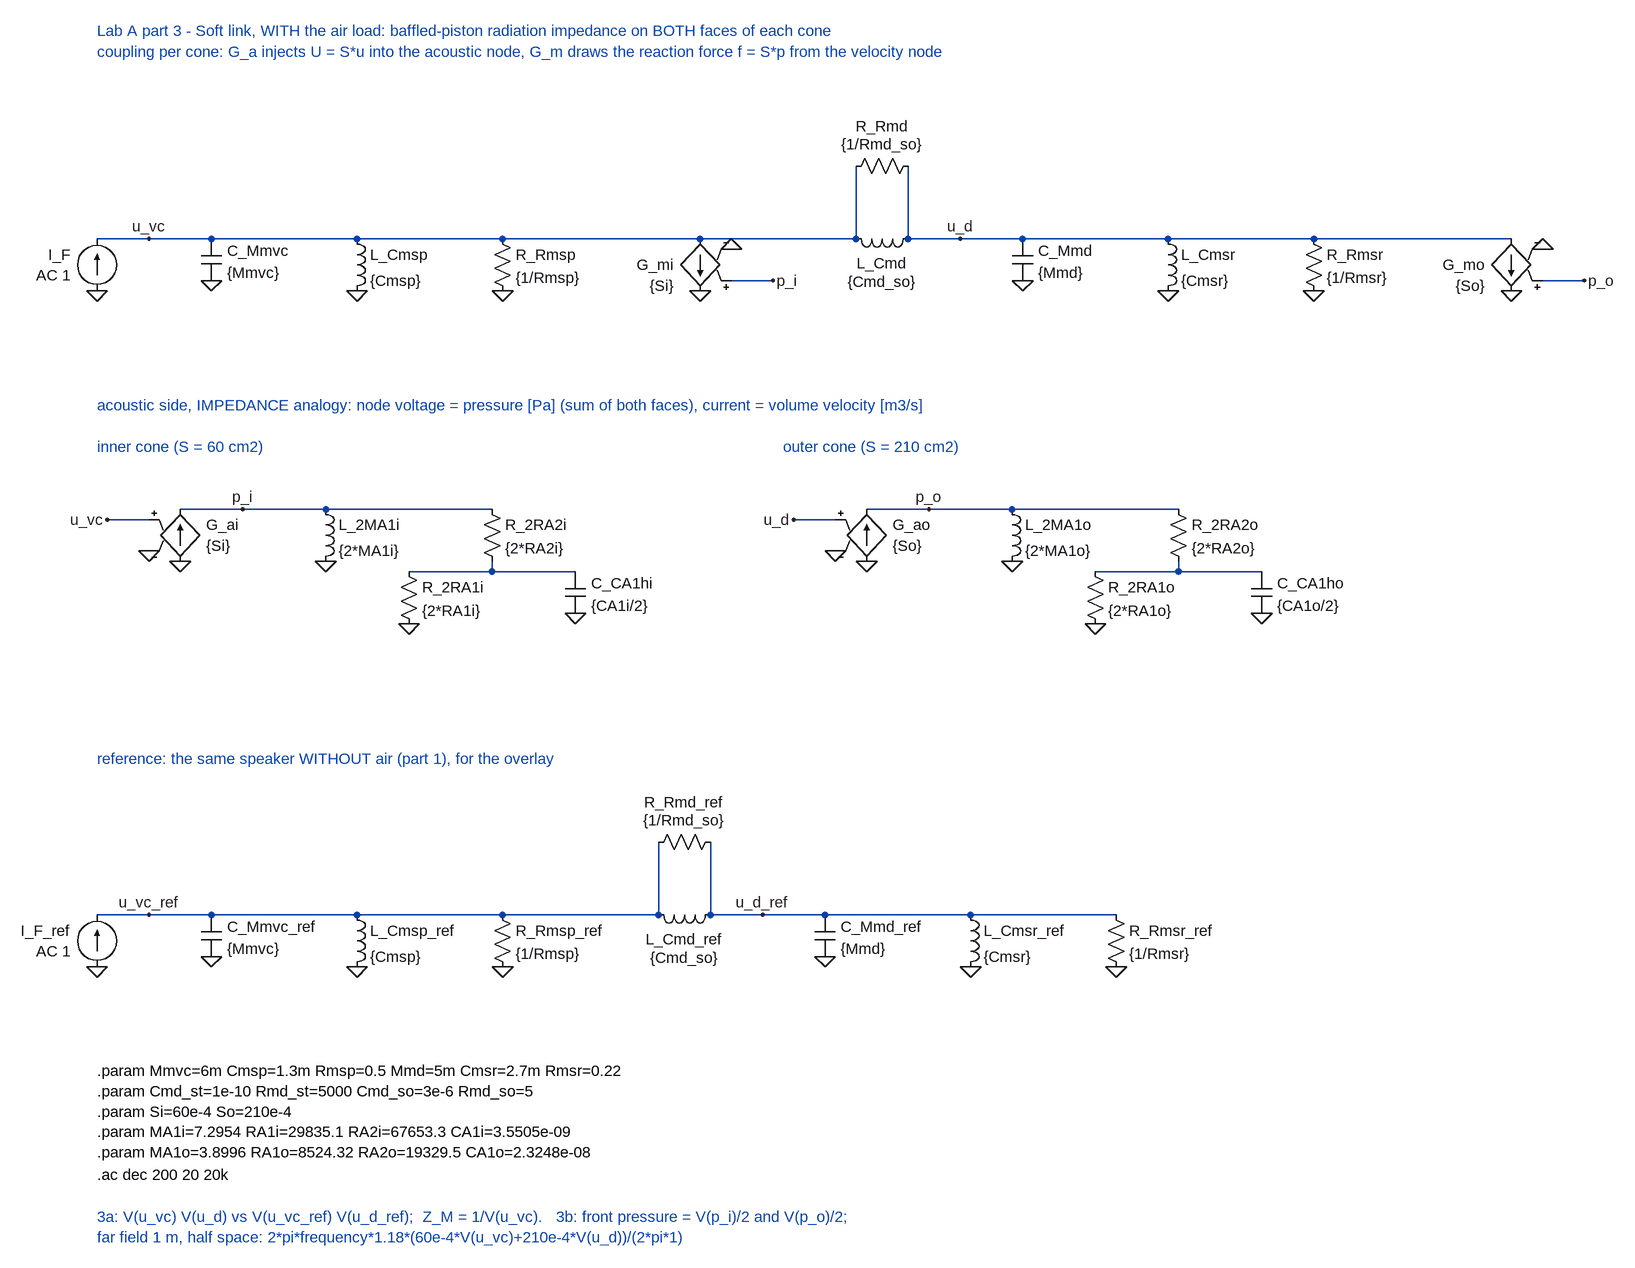
[diagram p0: schematic Part3_Coupled_Soft.asc]
Part3_Coupled_Soft.asc, the LTspice schematic file:
Version 4
SHEET 1 3000 1600
WIRE 976 64 1040 64
WIRE 0 0 1168 0
WIRE 1168 0 1168 -112
WIRE 1248 0 1248 -112
WIRE 2224 64 2288 64
WIRE 1248 0 2176 0
WIRE 80 432 16 432
WIRE 128 416 608 416
WIRE 608 496 608 512
WIRE 480 512 736 512
WIRE 1136 432 1072 432
WIRE 1184 416 1664 416
WIRE 1664 496 1664 512
WIRE 1536 512 1792 512
WIRE 0 1040 864 1040
WIRE 864 1040 864 928
WIRE 944 1040 944 928
WIRE 944 1040 1568 1040
FLAG 0 80 0
FLAG 80 0 u_vc
FLAG 176 64 0
FLAG 400 80 0
FLAG 624 80 0
FLAG 928 80 0
FLAG 976 16 0
FLAG 1040 64 p_i
FLAG 1328 0 u_d
FLAG 1424 64 0
FLAG 1648 80 0
FLAG 1872 80 0
FLAG 2176 80 0
FLAG 2224 16 0
FLAG 2288 64 p_o
FLAG 128 496 0
FLAG 80 480 0
FLAG 16 432 u_vc
FLAG 224 416 p_i
FLAG 352 496 0
FLAG 480 592 0
FLAG 736 576 0
FLAG 1184 496 0
FLAG 1136 480 0
FLAG 1072 432 u_d
FLAG 1280 416 p_o
FLAG 1408 496 0
FLAG 1536 592 0
FLAG 1792 576 0
FLAG 0 1120 0
FLAG 80 1040 u_vc_ref
FLAG 176 1104 0
FLAG 400 1120 0
FLAG 624 1120 0
FLAG 1024 1040 u_d_ref
FLAG 1120 1104 0
FLAG 1344 1120 0
FLAG 1568 1120 0
SYMBOL current 0 80 R180
WINDOW 0 40 56 Left 2
WINDOW 3 40 24 Left 2
SYMATTR InstName I_F
SYMATTR Value AC 1
SYMBOL cap 160 0 R0
WINDOW 0 40 18 Left 2
WINDOW 3 40 52 Left 2
SYMATTR InstName C_Mmvc
SYMATTR Value {Mmvc}
SYMBOL ind 384 -16 R0
SYMATTR InstName L_Cmsp
SYMATTR Value {Cmsp}
SYMATTR SpiceLine Rser=0
SYMBOL res 608 -16 R0
SYMATTR InstName R_Rmsp
SYMATTR Value {1/Rmsp}
SYMBOL g 928 96 R180
WINDOW 0 40 56 Left 2
WINDOW 3 40 24 Left 2
SYMATTR InstName G_mi
SYMATTR Value {Si}
SYMBOL ind 1264 -16 R90
WINDOW 0 38 56 VTop 2
WINDOW 3 66 56 VTop 2
SYMATTR InstName L_Cmd
SYMATTR Value {Cmd_so}
SYMATTR SpiceLine Rser=1u
SYMBOL res 1264 -128 R90
WINDOW 0 -30 56 VBottom 2
WINDOW 3 -2 56 VBottom 2
SYMATTR InstName R_Rmd
SYMATTR Value {1/Rmd_so}
SYMBOL cap 1408 0 R0
WINDOW 0 40 18 Left 2
WINDOW 3 40 52 Left 2
SYMATTR InstName C_Mmd
SYMATTR Value {Mmd}
SYMBOL ind 1632 -16 R0
SYMATTR InstName L_Cmsr
SYMATTR Value {Cmsr}
SYMATTR SpiceLine Rser=0
SYMBOL res 1856 -16 R0
SYMATTR InstName R_Rmsr
SYMATTR Value {1/Rmsr}
SYMBOL g 2176 96 R180
WINDOW 0 40 56 Left 2
WINDOW 3 40 24 Left 2
SYMATTR InstName G_mo
SYMATTR Value {So}
SYMBOL g 128 400 R0
WINDOW 0 40 40 Left 2
WINDOW 3 40 72 Left 2
SYMATTR InstName G_ai
SYMATTR Value {Si}
SYMBOL ind 336 400 R0
SYMATTR InstName L_2MA1i
SYMATTR Value {2*MA1i}
SYMATTR SpiceLine Rser=0
SYMBOL res 592 400 R0
SYMATTR InstName R_2RA2i
SYMATTR Value {2*RA2i}
SYMBOL res 464 496 R0
SYMATTR InstName R_2RA1i
SYMATTR Value {2*RA1i}
SYMBOL cap 720 512 R0
WINDOW 0 40 18 Left 2
WINDOW 3 40 52 Left 2
SYMATTR InstName C_CA1hi
SYMATTR Value {CA1i/2}
SYMBOL g 1184 400 R0
WINDOW 0 40 40 Left 2
WINDOW 3 40 72 Left 2
SYMATTR InstName G_ao
SYMATTR Value {So}
SYMBOL ind 1392 400 R0
SYMATTR InstName L_2MA1o
SYMATTR Value {2*MA1o}
SYMATTR SpiceLine Rser=0
SYMBOL res 1648 400 R0
SYMATTR InstName R_2RA2o
SYMATTR Value {2*RA2o}
SYMBOL res 1520 496 R0
SYMATTR InstName R_2RA1o
SYMATTR Value {2*RA1o}
SYMBOL cap 1776 512 R0
WINDOW 0 40 18 Left 2
WINDOW 3 40 52 Left 2
SYMATTR InstName C_CA1ho
SYMATTR Value {CA1o/2}
SYMBOL current 0 1120 R180
WINDOW 0 40 56 Left 2
WINDOW 3 40 24 Left 2
SYMATTR InstName I_F_ref
SYMATTR Value AC 1
SYMBOL cap 160 1040 R0
WINDOW 0 40 18 Left 2
WINDOW 3 40 52 Left 2
SYMATTR InstName C_Mmvc_ref
SYMATTR Value {Mmvc}
SYMBOL ind 384 1024 R0
SYMATTR InstName L_Cmsp_ref
SYMATTR Value {Cmsp}
SYMATTR SpiceLine Rser=0
SYMBOL res 608 1024 R0
SYMATTR InstName R_Rmsp_ref
SYMATTR Value {1/Rmsp}
SYMBOL ind 960 1024 R90
WINDOW 0 38 56 VTop 2
WINDOW 3 66 56 VTop 2
SYMATTR InstName L_Cmd_ref
SYMATTR Value {Cmd_so}
SYMATTR SpiceLine Rser=1u
SYMBOL res 960 912 R90
WINDOW 0 -30 56 VBottom 2
WINDOW 3 -2 56 VBottom 2
SYMATTR InstName R_Rmd_ref
SYMATTR Value {1/Rmd_so}
SYMBOL cap 1104 1040 R0
WINDOW 0 40 18 Left 2
WINDOW 3 40 52 Left 2
SYMATTR InstName C_Mmd_ref
SYMATTR Value {Mmd}
SYMBOL ind 1328 1024 R0
SYMATTR InstName L_Cmsr_ref
SYMATTR Value {Cmsr}
SYMATTR SpiceLine Rser=0
SYMBOL res 1552 1024 R0
SYMATTR InstName R_Rmsr_ref
SYMATTR Value {1/Rmsr}
TEXT 0 -320 Left 2 ;Lab A part 3 - Soft link, WITH the air load: baffled-piston radiation impedance on BOTH faces of each cone
TEXT 0 -288 Left 2 ;coupling per cone: G_a injects U = S*u into the acoustic node, G_m draws the reaction force f = S*p from the velocity node
TEXT 0 256 Left 2 ;acoustic side, IMPEDANCE analogy: node voltage = pressure [Pa] (sum of both faces), current = volume velocity [m3/s]
TEXT 0 320 Left 2 ;inner cone (S = 60 cm2)
TEXT 1056 320 Left 2 ;outer cone (S = 210 cm2)
TEXT 0 800 Left 2 ;reference: the same speaker WITHOUT air (part 1), for the overlay
TEXT 0 1280 Left 2 !.param Mmvc=6m Cmsp=1.3m Rmsp=0.5 Mmd=5m Cmsr=2.7m Rmsr=0.22\n.param Cmd_st=1e-10 Rmd_st=5000 Cmd_so=3e-6 Rmd_so=5\n.param Si=60e-4 So=210e-4\n.param MA1i=7.2954 RA1i=29835.1 RA2i=67653.3 CA1i=3.5505e-09\n.param MA1o=3.8996 RA1o=8524.32 RA2o=19329.5 CA1o=2.3248e-08
TEXT 0 1440 Left 2 !.ac dec 200 20 20k
TEXT 0 1504 Left 2 ;3a: V(u_vc) V(u_d) vs V(u_vc_ref) V(u_d_ref);  Z_M = 1/V(u_vc).   3b: front pressure = V(p_i)/2 and V(p_o)/2;
TEXT 0 1536 Left 2 ;far field 1 m, half space: 2*pi*frequency*1.18*(60e-4*V(u_vc)+210e-4*V(u_d))/(2*pi*1)

The netlist it stands for:
* Part3_Coupled_Soft.asc
I_F 0 u_vc AC 1
C_Mmvc u_vc 0 {Mmvc}
L_Cmsp u_vc 0 {Cmsp} Rser=0
R_Rmsp u_vc 0 {1/Rmsp}
G_mi u_vc 0 p_i 0 {Si}
L_Cmd u_d u_vc {Cmd_so} Rser=1u
R_Rmd u_d u_vc {1/Rmd_so}
C_Mmd u_d 0 {Mmd}
L_Cmsr u_d 0 {Cmsr} Rser=0
R_Rmsr u_d 0 {1/Rmsr}
G_mo u_d 0 p_o 0 {So}
G_ai 0 p_i u_vc 0 {Si}
L_2MA1i p_i 0 {2*MA1i} Rser=0
R_2RA2i p_i N001 {2*RA2i}
R_2RA1i N001 0 {2*RA1i}
C_CA1hi N001 0 {CA1i/2}
G_ao 0 p_o u_d 0 {So}
L_2MA1o p_o 0 {2*MA1o} Rser=0
R_2RA2o p_o N002 {2*RA2o}
R_2RA1o N002 0 {2*RA1o}
C_CA1ho N002 0 {CA1o/2}
I_F_ref 0 u_vc_ref AC 1
C_Mmvc_ref u_vc_ref 0 {Mmvc}
L_Cmsp_ref u_vc_ref 0 {Cmsp} Rser=0
R_Rmsp_ref u_vc_ref 0 {1/Rmsp}
L_Cmd_ref u_d_ref u_vc_ref {Cmd_so} Rser=1u
R_Rmd_ref u_d_ref u_vc_ref {1/Rmd_so}
C_Mmd_ref u_d_ref 0 {Mmd}
L_Cmsr_ref u_d_ref 0 {Cmsr} Rser=0
R_Rmsr_ref u_d_ref 0 {1/Rmsr}
* Lab A part 3 - Soft link, WITH the air load: baffled-piston radiation impedance on BOTH faces of each cone
* coupling per cone: G_a injects U = S*u into the acoustic node, G_m draws the reaction force f = S*p from the velocity node
* acoustic side, IMPEDANCE analogy: node voltage = pressure [Pa] (sum of both faces), current = volume velocity [m3/s]
* inner cone (S = 60 cm2)
* outer cone (S = 210 cm2)
* reference: the same speaker WITHOUT air (part 1), for the overlay
.param Mmvc=6m Cmsp=1.3m Rmsp=0.5 Mmd=5m Cmsr=2.7m Rmsr=0.22
.param Cmd_st=1e-10 Rmd_st=5000 Cmd_so=3e-6 Rmd_so=5
.param Si=60e-4 So=210e-4
.param MA1i=7.2954 RA1i=29835.1 RA2i=67653.3 CA1i=3.5505e-09
.param MA1o=3.8996 RA1o=8524.32 RA2o=19329.5 CA1o=2.3248e-08
.ac dec 200 20 20k
* 3a: V(u_vc) V(u_d) vs V(u_vc_ref) V(u_d_ref);  Z_M = 1/V(u_vc).   3b: front pressure = V(p_i)/2 and V(p_o)/2;
* far field 1 m, half space: 2*pi*frequency*1.18*(60e-4*V(u_vc)+210e-4*V(u_d))/(2*pi*1)
.backanno
.end